# Altium project Battery monitoring board.PrjPcb
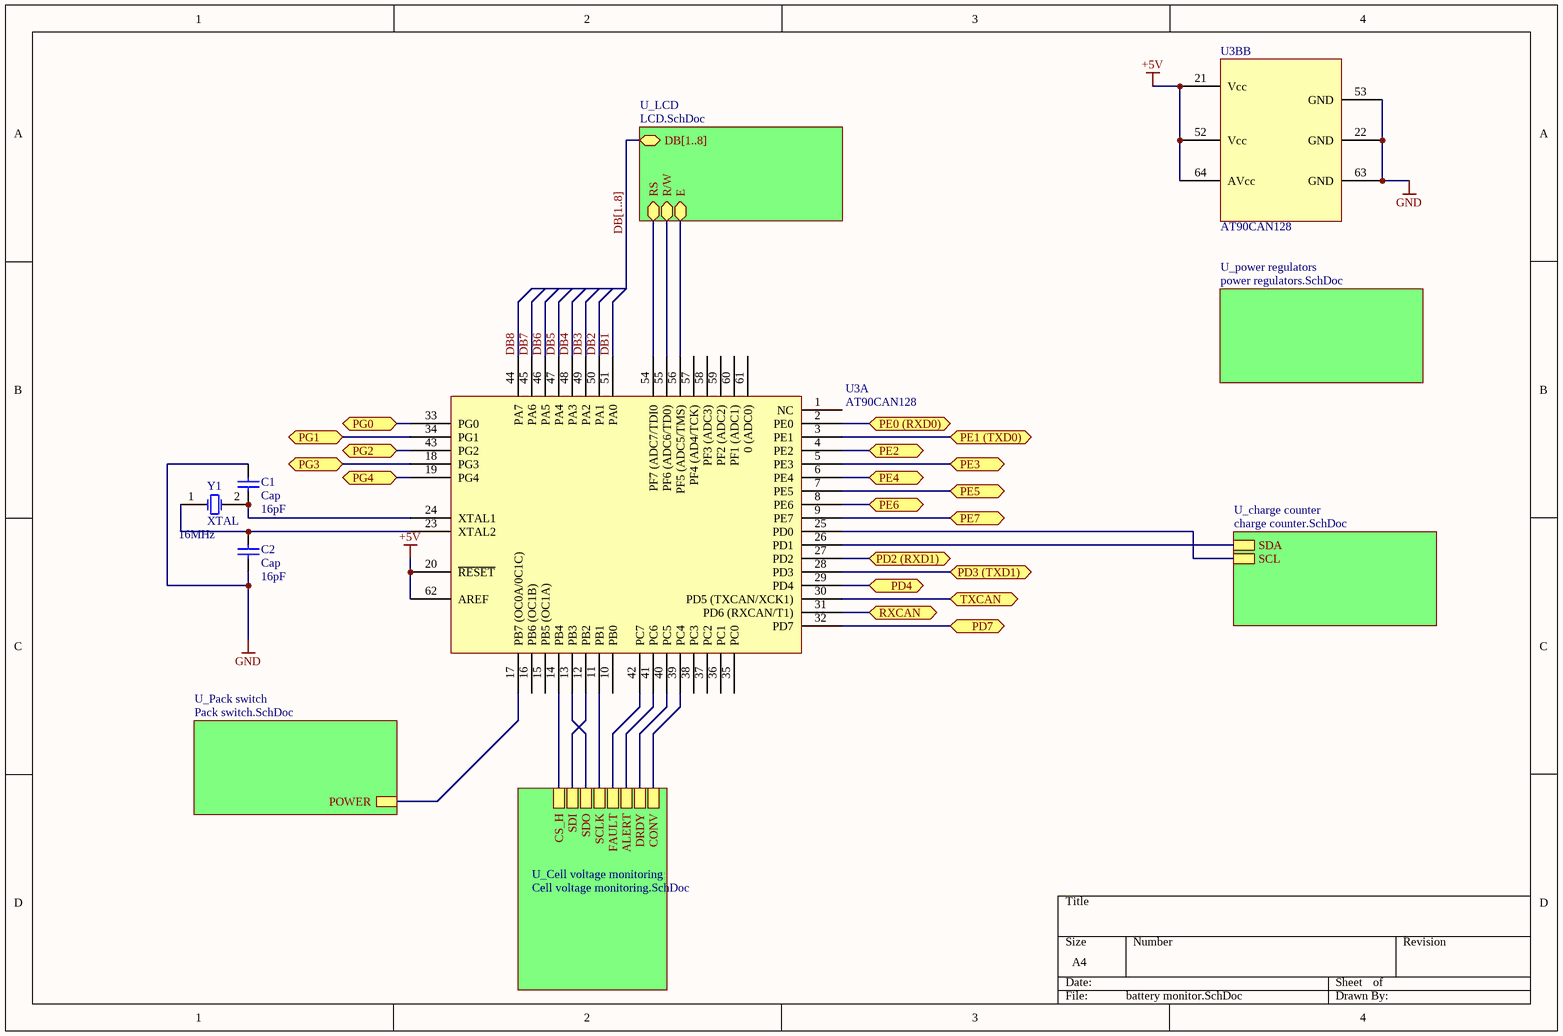
[diagram p0: battery monitor.SchDoc]
4 sheets, 23 parts. Net scope: hierarchical (ports join the sheet entries above them; power ports are global).
Sheets:
  battery monitor.SchDoc
    U_Pack switch = Pack switch.SchDoc
    U_LCD = LCD.SchDoc
  decouple_caps.SchDoc

## Sheet battery monitor.SchDoc
size A4

### Parts
C1  Cap  value 16pF  [C0805]
C2  Cap  value 16pF  [C0805]
U3  AT90CAN128  [TQFP80P1600X1600X120-64N]  (part A of 2)
U3B  AT90CAN128  [TQFP80P1600X1600X120-64N]  (part B of 2)
Y1  XTAL  value 16MHz  [R38]

### Sub-sheets
U_Cell voltage monitoring = Cell voltage monitoring.SchDoc (file not in this document): CONV, DRDY, ALERT, FAULT, SCLK, SDO, SDI, CS_H
U_charge counter = charge counter.SchDoc (file not in this document): SDA, SCL
U_LCD = LCD.SchDoc: DB[1..8] (bidir), RS, R/W, E
U_Pack switch = Pack switch.SchDoc: POWER
U_power regulators = power regulators.SchDoc (file not in this document): no entries

### Ports
PD2 (RXD1), PD3 (TXD1), PD4, PD7, PE0 (RXD0), PE1 (TXD0), PE2, PE3, PE4 (bidir), PE5, PE6, PE7, PG0, PG1, PG2, PG3, PG4, RXCAN, TXCAN

### Nets
+5V: U3.20(~{RESET}) U3.62(AREF) U3B.21(Vcc) U3B.52(Vcc) U3B.64(AVcc)
GND: C1.2 C2.2 U3B.22(GND) U3B.53(GND) U3B.63(GND)
DB1: U3.51(PA0)
DB2: U3.50(PA1)
DB3: U3.49(PA2)
DB4: U3.48(PA3)
DB5: U3.47(PA4)
DB6: U3.46(PA5)
DB7: U3.45(PA6)
DB8: U3.44(PA7)
E: U3.56(PF5_(ADC5/TMS)) ; sheet U_LCD/E
R/W: U3.55(PF6_(ADC6/TD0)) ; sheet U_LCD/R/W
RS: U3.54(PF7_(ADC7/TDI0) ; sheet U_LCD/RS
NetC1_1: C1.1 U3.24(XTAL1) Y1.2(OSC2)
NetC2_1: C2.1 U3.23(XTAL2) Y1.1(OSC1)
NetQ2_1: U3.17(PB7_(OC0A/0C1C)) ; sheet U_Pack switch/POWER
NetU3_2: U3.2(PE0) ; port PE0 (RXD0)
NetU3_3: U3.3(PE1) ; port PE1 (TXD0)
NetU3_4: U3.4(PE2) ; port PE2
NetU3_5: U3.5(PE3) ; port PE3
NetU3_6: U3.6(PE4) ; port PE4
NetU3_7: U3.7(PE5) ; port PE5
NetU3_8: U3.8(PE6) ; port PE6
NetU3_9: U3.9(PE7) ; port PE7
NetU3_11: U3.11(PB1) ; sheet U_Cell voltage monitoring/SCLK
NetU3_12: U3.12(PB2) ; sheet U_Cell voltage monitoring/SDI
NetU3_13: U3.13(PB3) ; sheet U_Cell voltage monitoring/SDO
NetU3_14: U3.14(PB4) ; sheet U_Cell voltage monitoring/CS_H
NetU3_18: U3.18(PG3) ; port PG3
NetU3_19: U3.19(PG4) ; port PG4
NetU3_25: U3.25(PD0) ; sheet U_charge counter/SCL
NetU3_26: U3.26(PD1) ; sheet U_charge counter/SDA
NetU3_27: U3.27(PD2) ; port PD2 (RXD1)
NetU3_28: U3.28(PD3) ; port PD3 (TXD1)
NetU3_29: U3.29(PD4) ; port PD4
NetU3_30: U3.30(PD5_(TXCAN/XCK1)) ; port TXCAN
NetU3_31: U3.31(PD6_(RXCAN/T1)) ; port RXCAN
NetU3_32: U3.32(PD7) ; port PD7
NetU3_33: U3.33(PG0) ; port PG0
NetU3_34: U3.34(PG1) ; port PG1
NetU3_39: U3.39(PC4) ; sheet U_Cell voltage monitoring/CONV
NetU3_40: U3.40(PC5) ; sheet U_Cell voltage monitoring/DRDY
NetU3_41: U3.41(PC6) ; sheet U_Cell voltage monitoring/ALERT
NetU3_42: U3.42(PC7) ; sheet U_Cell voltage monitoring/FAULT
NetU3_43: U3.43(PG2) ; port PG2

Not connected (* = marked no-connect by the designer): U3 1(NC) 10(PB0) 15(PB5_(OC1A)) 16(PB6_(OC1B)) 35(PC0) 36(PC1) 37(PC2) 38(PC3) 57(PF4_(AD4/TCK)) 58(PF3_(ADC3)) 59(PF2_(ADC2)) 60(PF1_(ADC1)) 61(0_(ADC0))

### Buses and harness runs
bus DB[1..8] = sheet U_LCD/DB[1..8]

### Library data of the parts
C1 C2 = Cap: Capacitor; Published: 8-Jun-2000; LatestRevisionDate: 17-Jul-2002; LatestRevisionNote: Re-released for DXP Platform.; PackageReference: RAD-0.3; Publisher: Altium Limited; PackageDescription: Radial Cap, Thru-Hole; 2 Leads; 0.3 in Pin Spacing
Y1 = XTAL: Crystal Oscillator; Published: 8-Jun-2000; LatestRevisionDate: 17-Jul-2002; LatestRevisionNote: Re-released for DXP Platform.; PackageReference: R38; Publisher: Altium Limited; farnell: 1842294rl

## Sheet Pack switch.SchDoc
size A4
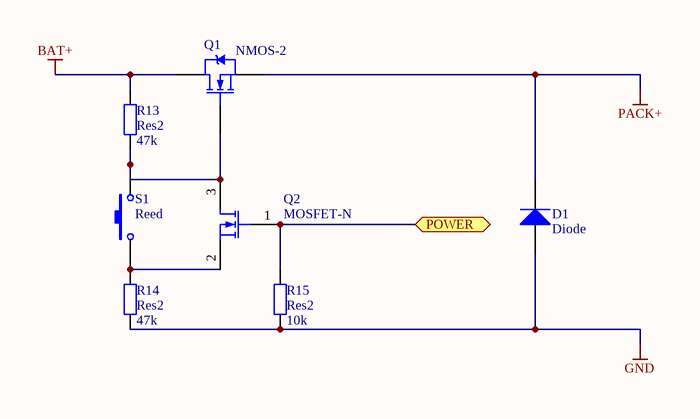
[diagram p1: Pack switch.SchDoc]

### Parts
D1  Diode  [SMC]
Q1  NMOS-2  [TO_263]
Q2  MOSFET-N  [2N7002]
R13  Res2  value 47k  [0603]
R14  Res2  value 47k  [0603]
R15  Res2  value 10k  [0603]
S1  Reed  [SPST-2]

### Ports
POWER

### Nets
BAT+: Q1.2(D) R13.2
GND: D1.1(A) R14.1 R15.1
PACK+: D1.2(K) Q1.3(S)
NetQ1_1: Q1.1(G) Q2.3(D) R13.1 S1.2
NetQ2_1: Q2.1(G) R15.2 ; port POWER
NetQ2_2: Q2.2(S) R14.2 S1.1

### Library data of the parts
D1 = Diode: Default Diode; part: multicomp s3k; farnell: 1625204rl
Q1 = NMOS-2: N-Channel Power MOSFET; part: sum110p04-05-e3; farnell: 1839011
Q2 = 2N7002: NXP - 2N7002 - MOSFET,N CH, 60V,0.3A,SOT23; farnell: 1510761
R13-R15 = Res2: Resistor; Published: 8-Jun-2000; LatestRevisionDate: 17-Jul-2002; LatestRevisionNote: Re-released for DXP Platform.; PackageReference: AXIAL-0.4; Publisher: Altium Limited; PackageDescription: Axial Device, Thru-Hole; 2 Leads; 0.4 in Pin Spacing
S1 = SW-PB: Switch; part: hamlim 59025-4-s-02-a; Farnell: 5540690

## Sheet LCD.SchDoc
size A4
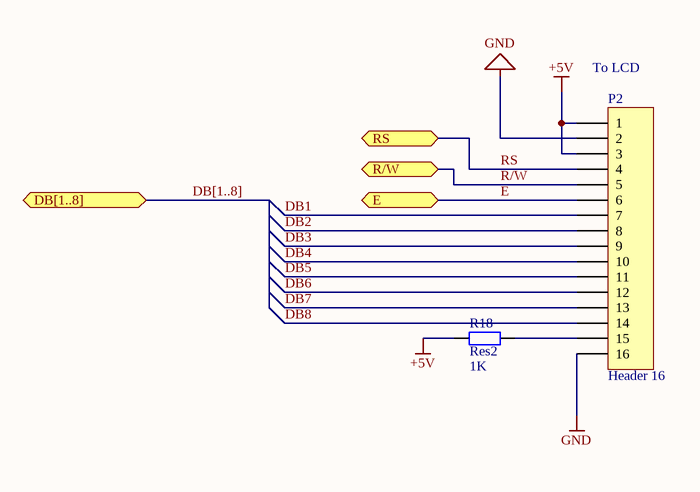
[diagram p2: LCD.SchDoc]

### Parts
P2  Header 16  [S16B-PUDSS-1]
R18  Res2  value 1K  [0603]

### Ports
DB[1..8] (bidir), E, R/W, RS

### Nets
+5V: P2.1 P2.3 R18.1
GND: P2.2 P2.16
DB1: P2.7
DB2: P2.8
DB3: P2.9
DB4: P2.10
DB5: P2.11
DB6: P2.12
DB7: P2.13
DB8: P2.14
E: P2.6 ; port E
R/W: P2.5 ; port R/W
RS: P2.4 ; port RS
NetP2_15: P2.15 R18.2

### Buses and harness runs
bus DB[1..8] = port DB[1..8]

### Notes on the sheet
- (near P2) To LCD

### Library data of the parts
P2 = Header 16: Header, 16-Pin; LatestRevisionDate: 17-Jul-2002; LatestRevisionNote: Re-released for DXP Platform.; Publisher: Altium Limited; farnell: 1830823
R18 = Res2: Resistor; Published: 8-Jun-2000; LatestRevisionDate: 17-Jul-2002; LatestRevisionNote: Re-released for DXP Platform.; PackageReference: AXIAL-0.4; Publisher: Altium Limited; PackageDescription: Axial Device, Thru-Hole; 2 Leads; 0.4 in Pin Spacing

## Sheet decouple_caps.SchDoc
size A4
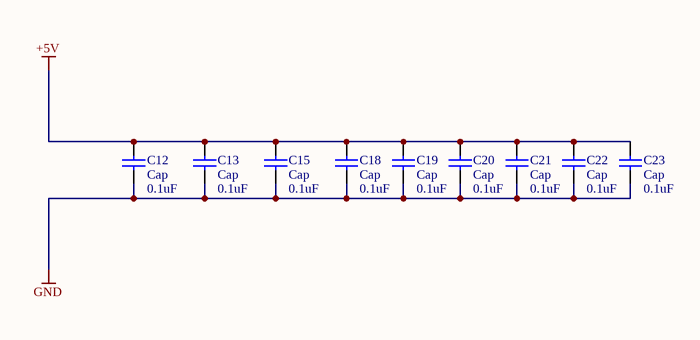
[diagram p3: decouple_caps.SchDoc]

### Parts
C12  Cap  value 0.1uF  [C0805]
C13  Cap  value 0.1uF  [C0805]
C15  Cap  value 0.1uF  [C0805]
C18  Cap  value 0.1uF  [C0805]
C19  Cap  value 0.1uF  [C0805]
C20  Cap  value 0.1uF  [C0805]
C21  Cap  value 0.1uF  [C0805]
C22  Cap  value 0.1uF  [C0805]
C23  Cap  value 0.1uF  [C0805]

### Nets
+5V: C12.2 C13.2 C15.2 C18.2 C19.2 C20.2 C21.2 C22.2 C23.2
GND: C12.1 C13.1 C15.1 C18.1 C19.1 C20.1 C21.1 C22.1 C23.1

### Library data of the parts
C12 C13 C15 C18-C23 = Cap: Capacitor; Published: 8-Jun-2000; LatestRevisionDate: 17-Jul-2002; LatestRevisionNote: Re-released for DXP Platform.; PackageReference: RAD-0.3; Publisher: Altium Limited; PackageDescription: Radial Cap, Thru-Hole; 2 Leads; 0.3 in Pin Spacing

## Nets that join several sheets
+5V: battery monitor (5 pins), LCD (P2.1 P2.3 R18.1), decouple_caps (9 pins)
GND: battery monitor (5 pins), Pack switch (D1.1 R14.1 R15.1), LCD (P2.2 P2.16), decouple_caps (9 pins)
DB1: battery monitor (U3.51), LCD (P2.7)
DB2: battery monitor (U3.50), LCD (P2.8)
DB3: battery monitor (U3.49), LCD (P2.9)
DB4: battery monitor (U3.48), LCD (P2.10)
DB5: battery monitor (U3.47), LCD (P2.11)
DB6: battery monitor (U3.46), LCD (P2.12)
DB7: battery monitor (U3.45), LCD (P2.13)
DB8: battery monitor (U3.44), LCD (P2.14)
E: battery monitor (U3.56), LCD (P2.6)
NetQ2_1: battery monitor (U3.17), Pack switch (Q2.1 R15.2)
R/W: battery monitor (U3.55), LCD (P2.5)
RS: battery monitor (U3.54), LCD (P2.4)